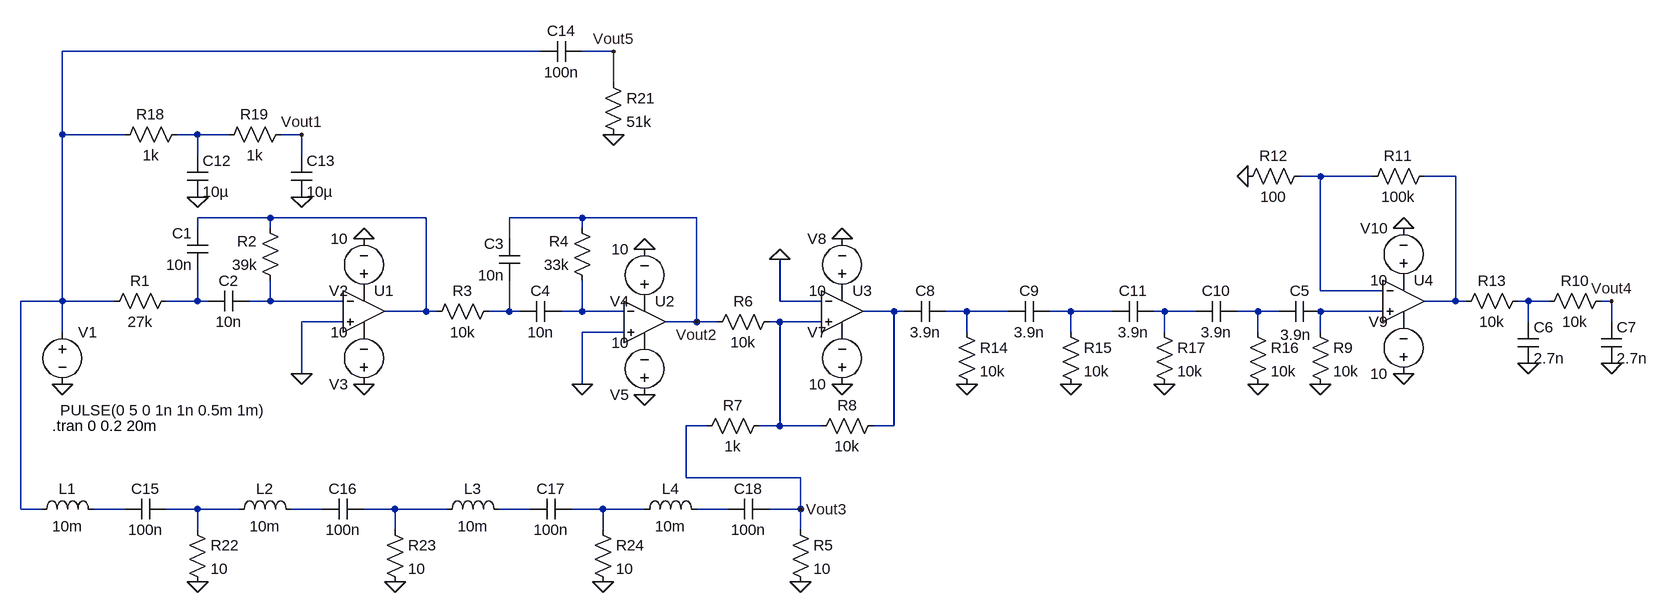
[diagram p0: schematic Project Simulation.asc]
Project Simulation.asc, the LTspice schematic file:
Version 4
SHEET 1 2452 680
WIRE -400 -352 -1136 -352
WIRE -288 -352 -336 -352
WIRE -288 -304 -288 -352
WIRE -1136 -224 -1136 -352
WIRE -1040 -224 -1136 -224
WIRE -928 -224 -960 -224
WIRE -880 -224 -928 -224
WIRE -768 -224 -800 -224
WIRE -928 -192 -928 -224
WIRE -768 -192 -768 -224
WIRE 800 -160 768 -160
WIRE 880 -160 800 -160
WIRE 1008 -160 960 -160
WIRE -816 -96 -928 -96
WIRE -576 -96 -816 -96
WIRE -336 -96 -448 -96
WIRE -160 -96 -336 -96
WIRE -928 -80 -928 -96
WIRE -816 -80 -816 -96
WIRE -336 -80 -336 -96
WIRE -448 -64 -448 -96
WIRE 800 16 800 -160
WIRE 896 16 800 16
WIRE -1136 32 -1136 -224
WIRE -1136 32 -1200 32
WIRE -1056 32 -1136 32
WIRE -928 32 -928 -16
WIRE -928 32 -976 32
WIRE -912 32 -928 32
WIRE -816 32 -816 0
WIRE -816 32 -848 32
WIRE -704 32 -816 32
WIRE -32 32 -32 -32
WIRE 32 32 -32 32
WIRE 1008 32 1008 -160
WIRE 1008 32 960 32
WIRE 1024 32 1008 32
WIRE 1120 32 1104 32
WIRE 1152 32 1120 32
WIRE 1248 32 1232 32
WIRE -576 48 -576 -96
WIRE -576 48 -640 48
WIRE -560 48 -576 48
WIRE -448 48 -448 0
WIRE -448 48 -480 48
WIRE -432 48 -448 48
WIRE -336 48 -336 0
WIRE -336 48 -368 48
WIRE -272 48 -336 48
WIRE 144 48 96 48
WIRE 160 48 144 48
WIRE 256 48 224 48
WIRE 320 48 256 48
WIRE 416 48 384 48
WIRE 480 48 416 48
WIRE 560 48 544 48
WIRE 608 48 560 48
WIRE 704 48 672 48
WIRE 736 48 704 48
WIRE 896 48 800 48
WIRE -704 64 -768 64
WIRE -160 64 -160 -96
WIRE -160 64 -208 64
WIRE -128 64 -160 64
WIRE -32 64 -48 64
WIRE 32 64 -32 64
WIRE 1120 64 1120 32
WIRE 1248 64 1248 32
WIRE -1136 80 -1136 32
WIRE -272 80 -336 80
WIRE 256 80 256 48
WIRE 416 80 416 48
WIRE 560 80 560 48
WIRE 704 80 704 48
WIRE 800 80 800 48
WIRE -768 144 -768 64
WIRE -336 160 -336 80
WIRE -144 224 -176 224
WIRE -32 224 -32 64
WIRE -32 224 -64 224
WIRE 32 224 -32 224
WIRE 144 224 144 48
WIRE 144 224 112 224
WIRE -176 304 -176 224
WIRE 0 304 -176 304
WIRE -1200 352 -1200 32
WIRE -1168 352 -1200 352
WIRE -1040 352 -1088 352
WIRE -928 352 -976 352
WIRE -864 352 -928 352
WIRE -736 352 -784 352
WIRE -624 352 -672 352
WIRE -544 352 -624 352
WIRE -416 352 -464 352
WIRE -304 352 -352 352
WIRE -240 352 -304 352
WIRE -112 352 -160 352
WIRE 0 352 0 304
WIRE 0 352 -48 352
WIRE -928 384 -928 352
WIRE -624 384 -624 352
WIRE -304 384 -304 352
WIRE 0 384 0 352
FLAG -1136 160 0
FLAG -768 144 0
FLAG -672 -64 0
FLAG -672 160 0
FLAG -336 160 0
FLAG -240 -48 0
FLAG -240 176 0
FLAG -32 -32 0
FLAG 64 -64 0
FLAG 64 160 0
FLAG 800 160 0
FLAG 928 144 0
FLAG 928 -80 0
FLAG 1120 128 0
FLAG 688 -160 0
FLAG 256 160 0
FLAG 1248 128 0
FLAG 416 160 0
FLAG 704 160 0
FLAG 560 160 0
FLAG -928 -128 0
FLAG -768 -128 0
FLAG 1248 32 Vout4
FLAG -160 64 Vout2
FLAG -288 -224 0
FLAG -288 -352 Vout5
FLAG -928 464 0
FLAG -624 464 0
FLAG -304 464 0
FLAG 0 464 0
FLAG 0 352 Vout3
FLAG -768 -224 Vout1
SYMBOL voltage -1136 64 R0
WINDOW 3 -3 136 Left 2
WINDOW 123 0 0 Left 0
WINDOW 39 0 0 Left 0
SYMATTR Value PULSE(0 5 0 1n 1n 0.5m 1m)
SYMATTR InstName V1
SYMBOL voltage -672 32 R180
WINDOW 123 0 0 Left 0
WINDOW 39 0 0 Left 0
SYMATTR InstName V2
SYMATTR Value 10
SYMBOL voltage -672 176 R180
WINDOW 123 0 0 Left 0
WINDOW 39 0 0 Left 0
SYMATTR InstName V3
SYMATTR Value 10
SYMBOL res -800 16 R180
WINDOW 0 36 76 Left 2
WINDOW 3 36 40 Left 2
SYMATTR InstName R2
SYMATTR Value 39k
SYMBOL cap -912 -80 M0
SYMATTR InstName C1
SYMATTR Value 10n
SYMBOL cap -848 16 R90
WINDOW 0 0 32 VBottom 2
WINDOW 3 32 32 VTop 2
SYMATTR InstName C2
SYMATTR Value 10n
SYMBOL voltage -240 48 R180
WINDOW 123 0 0 Left 0
WINDOW 39 0 0 Left 0
SYMATTR InstName V4
SYMATTR Value 10
SYMBOL voltage -240 192 R180
WINDOW 123 0 0 Left 0
WINDOW 39 0 0 Left 0
SYMATTR InstName V5
SYMATTR Value 10
SYMBOL res -464 32 R90
WINDOW 0 0 56 VBottom 2
WINDOW 3 32 56 VTop 2
SYMATTR InstName R3
SYMATTR Value 10k
SYMBOL res -320 16 R180
WINDOW 0 36 76 Left 2
WINDOW 3 36 40 Left 2
SYMATTR InstName R4
SYMATTR Value 33k
SYMBOL cap -432 -64 M0
SYMATTR InstName C3
SYMATTR Value 10n
SYMBOL cap -368 32 R90
WINDOW 0 0 32 VBottom 2
WINDOW 3 32 32 VTop 2
SYMATTR InstName C4
SYMATTR Value 10n
SYMBOL OpAmps\\UniversalOpAmp2 64 48 R0
SYMATTR InstName U3
SYMBOL res -32 48 R90
WINDOW 0 0 56 VBottom 2
WINDOW 3 32 56 VTop 2
SYMATTR InstName R6
SYMATTR Value 10k
SYMBOL res -160 240 R270
WINDOW 0 32 56 VTop 2
WINDOW 3 0 56 VBottom 2
SYMATTR InstName R7
SYMATTR Value 1k
SYMBOL res 128 208 R90
WINDOW 0 0 56 VBottom 2
WINDOW 3 32 56 VTop 2
SYMATTR InstName R8
SYMATTR Value 10k
SYMBOL voltage 64 176 R180
WINDOW 0 24 96 Left 2
WINDOW 3 24 16 Left 2
SYMATTR InstName V7
SYMATTR Value 10
SYMBOL voltage 64 32 R180
WINDOW 0 24 96 Left 2
WINDOW 3 24 16 Left 2
SYMATTR InstName V8
SYMATTR Value 10
SYMBOL cap 800 32 R90
WINDOW 0 0 32 VBottom 2
WINDOW 3 36 38 VTop 2
SYMATTR InstName C5
SYMATTR Value 3.9n
SYMBOL res 784 64 R0
SYMATTR InstName R9
SYMATTR Value 10k
SYMBOL OpAmps\\UniversalOpAmp2 928 32 R0
SYMATTR InstName U4
SYMBOL voltage 928 160 R180
WINDOW 0 24 96 Left 2
WINDOW 3 24 16 Left 2
WINDOW 123 0 0 Left 0
WINDOW 39 0 0 Left 0
SYMATTR InstName V9
SYMATTR Value 10
SYMBOL voltage 928 16 R180
WINDOW 0 24 96 Left 2
WINDOW 3 24 16 Left 2
SYMATTR InstName V10
SYMATTR Value 10
SYMBOL res 976 -176 R90
WINDOW 0 0 56 VBottom 2
WINDOW 3 32 56 VTop 2
SYMATTR InstName R11
SYMATTR Value 100k
SYMBOL res 784 -176 R90
WINDOW 0 0 56 VBottom 2
WINDOW 3 32 56 VTop 2
SYMATTR InstName R12
SYMATTR Value 100
SYMBOL res 1120 16 R90
WINDOW 0 0 56 VBottom 2
WINDOW 3 32 56 VTop 2
SYMATTR InstName R13
SYMATTR Value 10k
SYMBOL cap 1104 64 R0
SYMATTR InstName C6
SYMATTR Value 2.7n
SYMBOL res 1248 16 R90
WINDOW 0 0 56 VBottom 2
WINDOW 3 32 56 VTop 2
SYMATTR InstName R10
SYMATTR Value 10k
SYMBOL cap 1232 64 R0
SYMATTR InstName C7
SYMATTR Value 2.7n
SYMBOL cap 224 32 R90
WINDOW 0 0 32 VBottom 2
WINDOW 3 32 32 VTop 2
SYMATTR InstName C8
SYMATTR Value 3.9n
SYMBOL res 240 64 R0
SYMATTR InstName R14
SYMATTR Value 10k
SYMBOL cap 384 32 R90
WINDOW 0 0 32 VBottom 2
WINDOW 3 32 32 VTop 2
SYMATTR InstName C9
SYMATTR Value 3.9n
SYMBOL cap 672 32 R90
WINDOW 0 0 32 VBottom 2
WINDOW 3 32 32 VTop 2
SYMATTR InstName C10
SYMATTR Value 3.9n
SYMBOL res 400 64 R0
SYMATTR InstName R15
SYMATTR Value 10k
SYMBOL res 688 64 R0
SYMATTR InstName R16
SYMATTR Value 10k
SYMBOL cap 544 32 R90
WINDOW 0 0 32 VBottom 2
WINDOW 3 32 32 VTop 2
SYMATTR InstName C11
SYMATTR Value 3.9n
SYMBOL res 544 64 R0
SYMATTR InstName R17
SYMATTR Value 10k
SYMBOL res -944 -240 R90
WINDOW 0 0 56 VBottom 2
WINDOW 3 32 56 VTop 2
SYMATTR InstName R18
SYMATTR Value 1k
SYMBOL res -784 -240 R90
WINDOW 0 0 56 VBottom 2
WINDOW 3 32 56 VTop 2
SYMATTR InstName R19
SYMATTR Value 1k
SYMBOL cap -944 -192 R0
SYMATTR InstName C12
SYMATTR Value 10µ
SYMBOL cap -784 -192 R0
SYMATTR InstName C13
SYMATTR Value 10µ
SYMBOL res -304 -320 R0
SYMATTR InstName R21
SYMATTR Value 51k
SYMBOL cap -336 -368 R90
WINDOW 0 0 32 VBottom 2
WINDOW 3 32 32 VTop 2
SYMATTR InstName C14
SYMATTR Value 100n
SYMBOL ind -1184 368 R270
WINDOW 0 32 56 VTop 2
WINDOW 3 5 56 VBottom 2
SYMATTR InstName L1
SYMATTR Value 10m
SYMBOL cap -976 336 R90
WINDOW 0 0 32 VBottom 2
WINDOW 3 32 32 VTop 2
SYMATTR InstName C15
SYMATTR Value 100n
SYMBOL res -944 368 R0
SYMATTR InstName R22
SYMATTR Value 10
SYMBOL ind -880 368 R270
WINDOW 0 32 56 VTop 2
WINDOW 3 5 56 VBottom 2
SYMATTR InstName L2
SYMATTR Value 10m
SYMBOL cap -672 336 R90
WINDOW 0 0 32 VBottom 2
WINDOW 3 32 32 VTop 2
SYMATTR InstName C16
SYMATTR Value 100n
SYMBOL res -640 368 R0
SYMATTR InstName R23
SYMATTR Value 10
SYMBOL ind -560 368 R270
WINDOW 0 32 56 VTop 2
WINDOW 3 5 56 VBottom 2
SYMATTR InstName L3
SYMATTR Value 10m
SYMBOL cap -352 336 R90
WINDOW 0 0 32 VBottom 2
WINDOW 3 32 32 VTop 2
SYMATTR InstName C17
SYMATTR Value 100n
SYMBOL res -320 368 R0
SYMATTR InstName R24
SYMATTR Value 10
SYMBOL ind -256 368 R270
WINDOW 0 32 56 VTop 2
WINDOW 3 5 56 VBottom 2
SYMATTR InstName L4
SYMATTR Value 10m
SYMBOL cap -48 336 R90
WINDOW 0 0 32 VBottom 2
WINDOW 3 32 32 VTop 2
SYMATTR InstName C18
SYMATTR Value 100n
SYMBOL res -960 16 R90
WINDOW 0 0 56 VBottom 2
WINDOW 3 32 56 VTop 2
SYMATTR InstName R1
SYMATTR Value 27k
SYMBOL OpAmps\\UniversalOpAmp2 -672 48 R0
SYMATTR InstName U1
SYMBOL OpAmps\\UniversalOpAmp2 -240 64 R0
SYMATTR InstName U2
SYMBOL res -16 368 R0
SYMATTR InstName R5
SYMATTR Value 10
TEXT -1152 224 Left 2 !.tran 0 0.2 20m

The netlist it stands for:
* Project Simulation.asc
V1 N001 0 PULSE(0 5 0 1n 1n 0.5m 1m)
V2 P001 0 10
V3 0 P002 10
R2 N007 N005 39k
C1 N005 N006 10n
C2 N007 N006 10n
V4 P003 0 10
V5 0 P004 10
R3 N009 N005 10k
R4 N010 Vout2 33k
C3 Vout2 N009 10n
C4 N010 N009 10n
XU3 N017 0 P005 P006 N011 level2 Avol=1Meg GBW=10Meg Slew=10Meg Ilimit=25m Rail=0 Vos=0 En=0 Enk=0 In=0 Ink=0 Rin=500Meg  ; pins In+ In- V+ V- OUT
R6 N017 Vout2 10k
R7 Vout3 N017 1k
R8 N011 N017 10k
V7 0 P006 10
V8 P005 0 10
C5 N016 N015 3.9n
R9 N016 0 10k
XU4 N016 N003 P007 P008 N004 level2 Avol=1Meg GBW=10Meg Slew=10Meg Ilimit=25m Rail=0 Vos=0 En=0 Enk=0 In=0 Ink=0 Rin=500Meg  ; pins In+ In- V+ V- OUT
V9 0 P008 10
V10 P007 0 10
R11 N004 N003 100k
R12 N003 0 100
R13 N008 N004 10k
C6 N008 0 2.7n
R10 Vout4 N008 10k
C7 Vout4 0 2.7n
C8 N012 N011 3.9n
R14 N012 0 10k
C9 N013 N012 3.9n
C10 N015 N014 3.9n
R15 N013 0 10k
R16 N015 0 10k
C11 N014 N013 3.9n
R17 N014 0 10k
R18 N002 N001 1k
R19 Vout1 N002 1k
C12 N002 0 10µ
C13 Vout1 0 10µ
R21 Vout5 0 51k
C14 Vout5 N001 100n
L1 N001 N018 10m
C15 N019 N018 100n
R22 N019 0 10
L2 N019 N020 10m
C16 N021 N020 100n
R23 N021 0 10
L3 N021 N022 10m
C17 N023 N022 100n
R24 N023 0 10
L4 N023 N024 10m
C18 Vout3 N024 100n
R1 N006 N001 27k
XU1 0 N007 P001 P002 N005 level2 Avol=1Meg GBW=10Meg Slew=10Meg Ilimit=25m Rail=0 Vos=0 En=0 Enk=0 In=0 Ink=0 Rin=500Meg  ; pins In+ In- V+ V- OUT
XU2 0 N010 P003 P004 Vout2 level2 Avol=1Meg GBW=10Meg Slew=10Meg Ilimit=25m Rail=0 Vos=0 En=0 Enk=0 In=0 Ink=0 Rin=500Meg  ; pins In+ In- V+ V- OUT
R5 Vout3 0 10
.tran 0 0.2 20m
.lib UniversalOpAmp2.lib
.backanno
.end